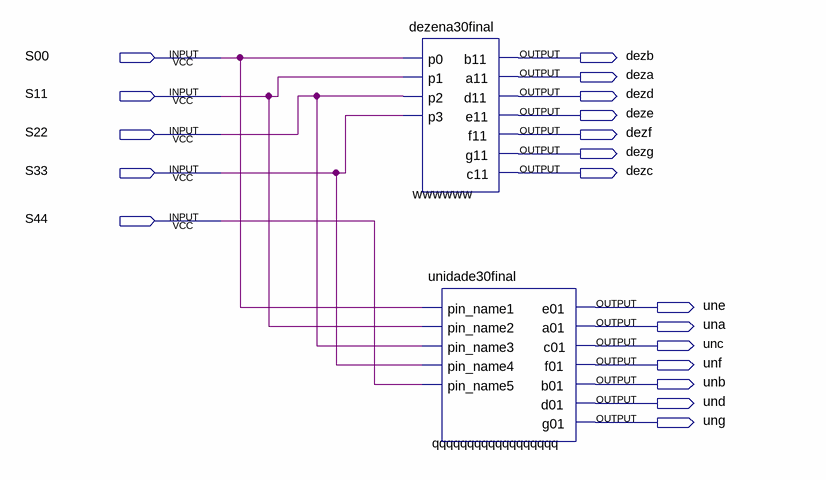
[diagram p0: schematic sheet]
// Quartus schematic decodercompletofinal5bits.bdf as structural Verilog: 2 symbols, 19 pins
module decodercompletofinal5bits (
  input  S00,
  input  S11,
  input  S22,
  input  S33,
  input  S44,
  output dezb,
  output deza,
  output dezd,
  output deze,
  output dezf,
  output dezg,
  output dezc,
  output une,
  output una,
  output unc,
  output unf,
  output unb,
  output und,
  output ung
);

  dezena30final wwwwww (
    .p0(S00), .p1(S11), .p2(S22), .p3(S33), .b11(dezb), .a11(deza), .d11(dezd), .e11(deze), .f11(dezf),
    .g11(dezg), .c11(dezc));
  unidade30final qqqqqqqqqqqqqqqqqq (
    .pin_name1(S00), .pin_name2(S11), .pin_name3(S22), .pin_name4(S33), .pin_name5(S44), .e01(une),
    .a01(una), .c01(unc), .f01(unf), .b01(unb), .d01(und), .g01(ung));
endmodule
